# Altium schematic sheet WIFISocket.SchDoc
size A4
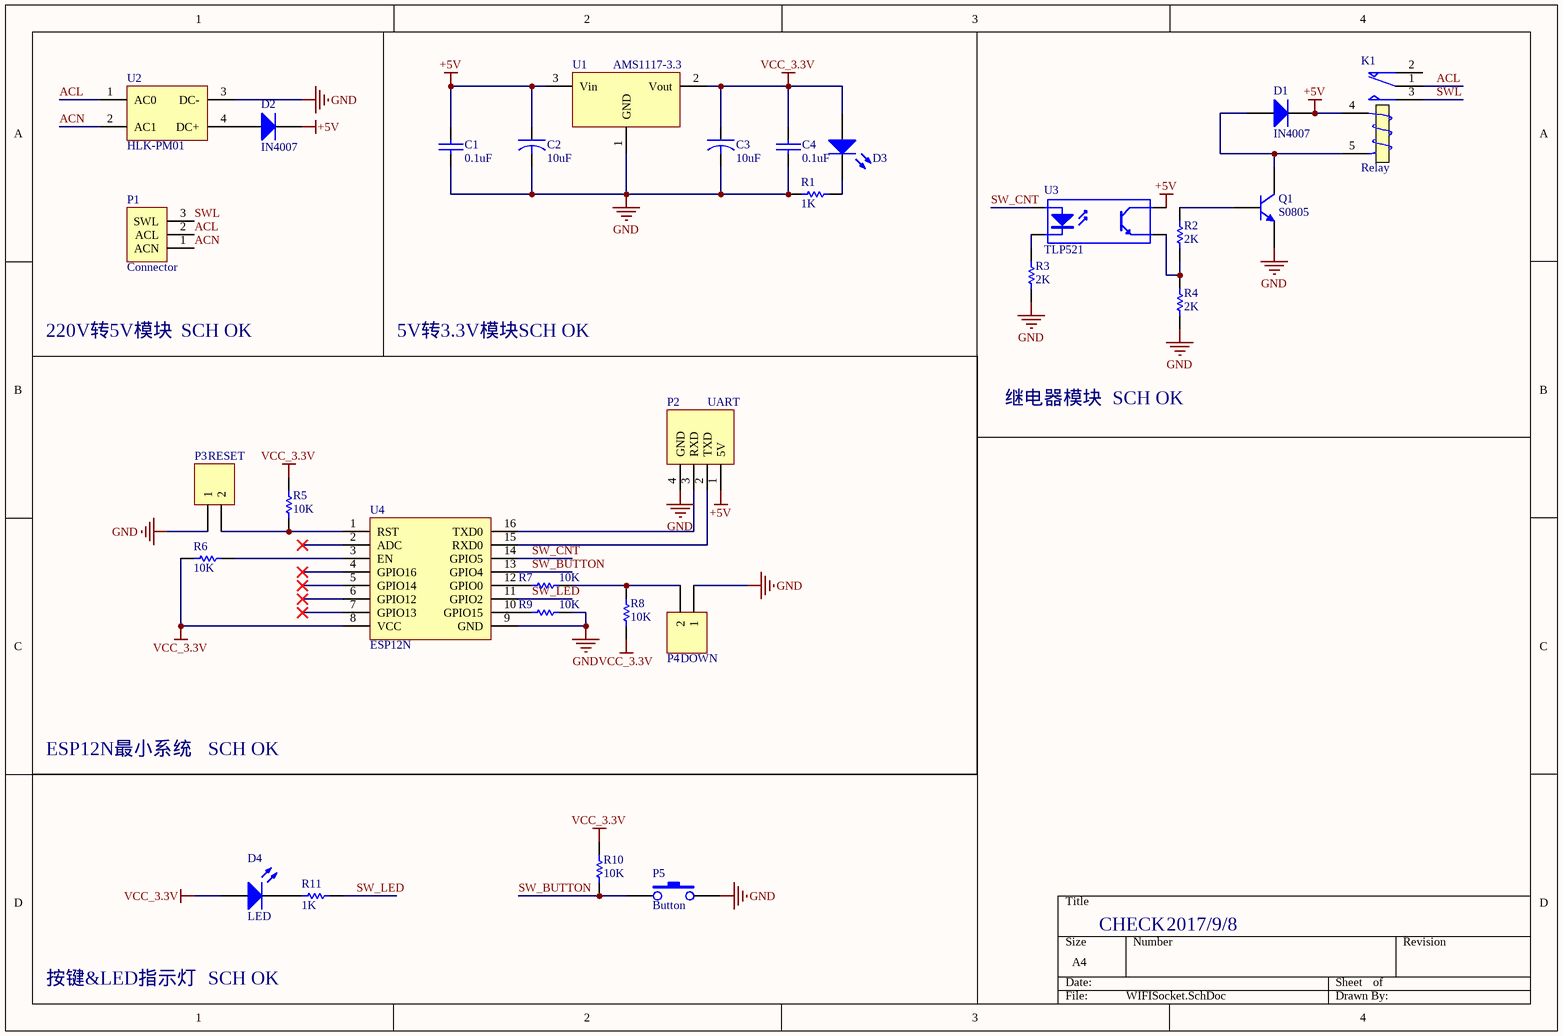
[diagram p0: WIFISocket.SchDoc]

## Parts
C1  0.1uF  [0603A]
C2  10uF  [0603A]
C3  10uF  [0603A]
C4  0.1uF  [0603A]
D1  IN4007  [1N4007]
D2  IN4007  [1N4007]
D3  LED  [LED]  (value not drawn)
D4  LED  [LED]
K1  Relay  [Relay]
P1  Connector  [KF128-3P]
P2  UART  [HDR1X4]
P3  RESET  [HDR1X2]
P4  DOWN  [HDR1X2]
P5  Button  [BUTTON]
Q1  S0805  [SOT23]
R1  value 1K  [0603R]  (hidden comment: Res)
R2  value 2K  [0603R]  (hidden comment: Res)
R3  value 2K  [0603R]  (hidden comment: Res)
R4  value 2K  [0603R]  (hidden comment: Res)
R5  value 10K  [0603R]  (hidden comment: Res)
R6  value 10K  [0603R]  (hidden comment: Res)
R7  value 10K  [0603R]  (hidden comment: Res)
R8  value 10K  [0603R]  (hidden comment: Res)
R9  value 10K  [0603R]  (hidden comment: Res)
R10  value 10K  [0603R]  (hidden comment: Res)
R11  value 1K  [0603R]  (hidden comment: Res)
U1  AMS1117-3.3  [AMS1117-3.3]
U2  HLK-PM01  [HLK_PM01]
U3  TLP521  [DIP-4]
U4  ESP12N  [ESP_12]

## Nets
+5V: C1.1 C2.1 D1.2(K) D2.2(K) K1.4(T1) P2.1(5V) U1.3(Vin) U3.4(C)
GND: C1.2 C2.2 C3.2 C4.2 P2.4(GND) P3.1 P4.1 P5.2 Q1.E R1.1 R3.1 R4.1 R9.2 U1.1(GND) U2.3(DC-) U4.9(GND)
VCC_3.3V: C3.1 C4.1 D3.1(A) D4.1(A) R5.2 R6.1 R8.1 R10.2 U1.2(Vout) U4.8(VCC)
ACL: K1.1(COM) P1.2(ACL) U2.1(AC0)
ACN: P1.1(ACN) U2.2(AC1)
SW_BUTTON: P5.1 R10.1 U4.13(GPIO4)
SW_CNT: U3.1(A) U4.14(GPIO5)
SW_LED: R11.1 U4.11(GPIO2)
SWL: K1.3(NO) P1.3(SWL)
NetD1_1: D1.1(A) K1.5(T2) Q1.C
NetD2_1: D2.1(A) U2.4(DC+)
NetD3_2: D3.2(K) R1.2
NetD4_2: D4.2(K) R11.2
NetP2_2: P2.2(TXD) U4.15(RXD0)
NetP2_3: P2.3(RXD) U4.16(TXD0)
NetP3_2: P3.2 R5.1 U4.1(RST)
NetP4_2: P4.2 R7.2 R8.2
NetQ1_B: Q1.B R2.2
NetR2_1: R2.1 R4.2 U3.3(E)
NetR3_2: R3.2 U3.2(K)
NetR6_2: R6.2 U4.3(EN)
NetR7_1: R7.1 U4.12(GPIO0)
NetR9_1: R9.1 U4.10(GPIO15)

Not connected (* = marked no-connect by the designer): K1 2(NC); U4 2(ADC)* 4(GPIO16)* 5(GPIO14)* 6(GPIO12)* 7(GPIO13)*

## Notes on the sheet
- 220V转5V模块
- SCH OK
- 5V转3.3V模块
- 继电器模块
- ESP12N最小系统
- 按键&LED指示灯
- CHECK
- 2017/9/8

## Library data of the parts
C1 C4 = CAP: Capacitor
C2 C3 = CAPACITOR
D1 D2 = IN4007: 整流二极管
D3 D4 = LED: pin to pad: 1>A 2>K
K1 = Relay: SPDT Relay
P1 = Socket: 220V插座焊盘
P2 = UART: UART下载接口
P3 P4 = Header 2: Header, 2-Pin
P5 = Button: 按键
Q1 = S0805: NPN
R1-R11 = Res: Resistor
U1 = AMS1117-3.3: 5V转3V
U2 = HLK-PM01: 220V AC转5V DC模块
U3 = Optoisolator: 光耦
U4 = ESP12N: ESP12N无线模块